# Altium schematic sheet Laser.SchDoc
size A2
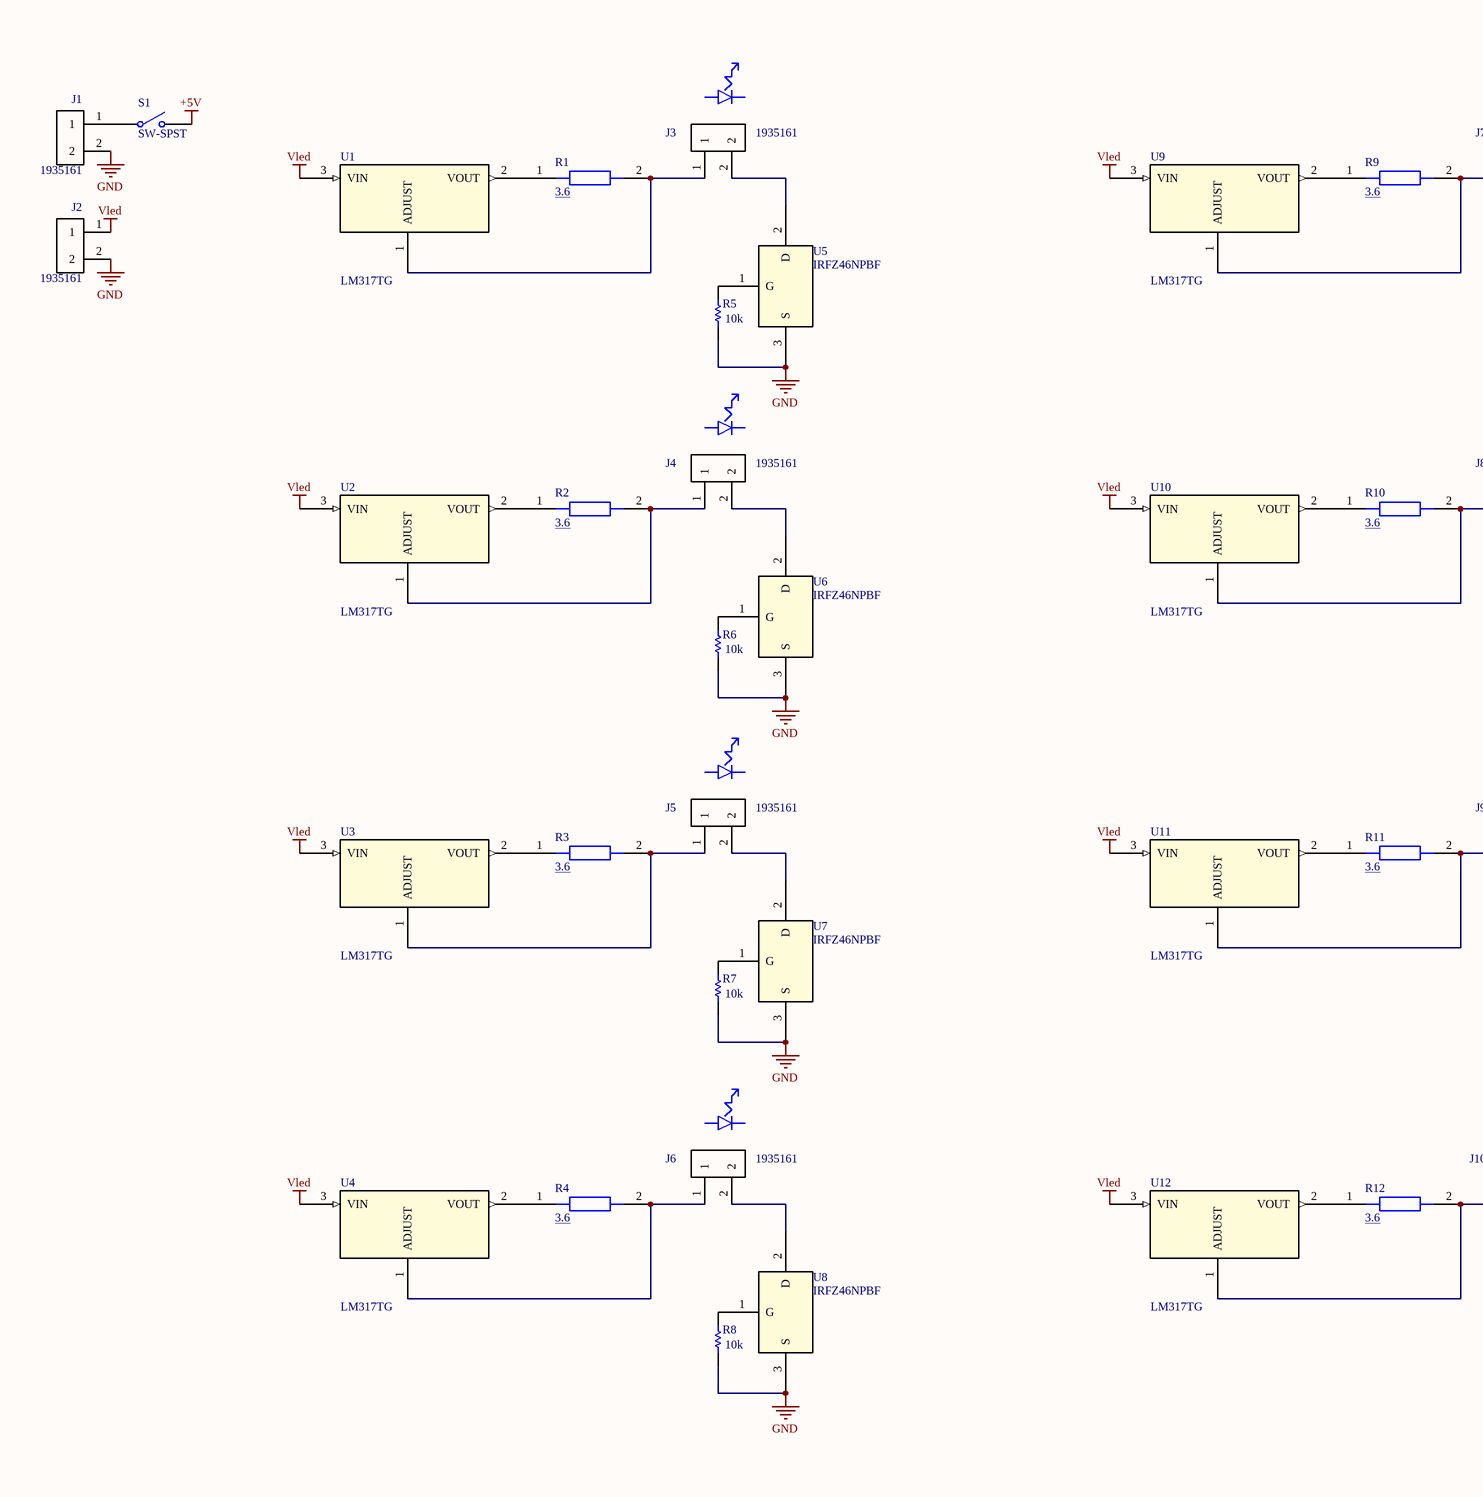
[diagram p0: Laser.SchDoc, left]
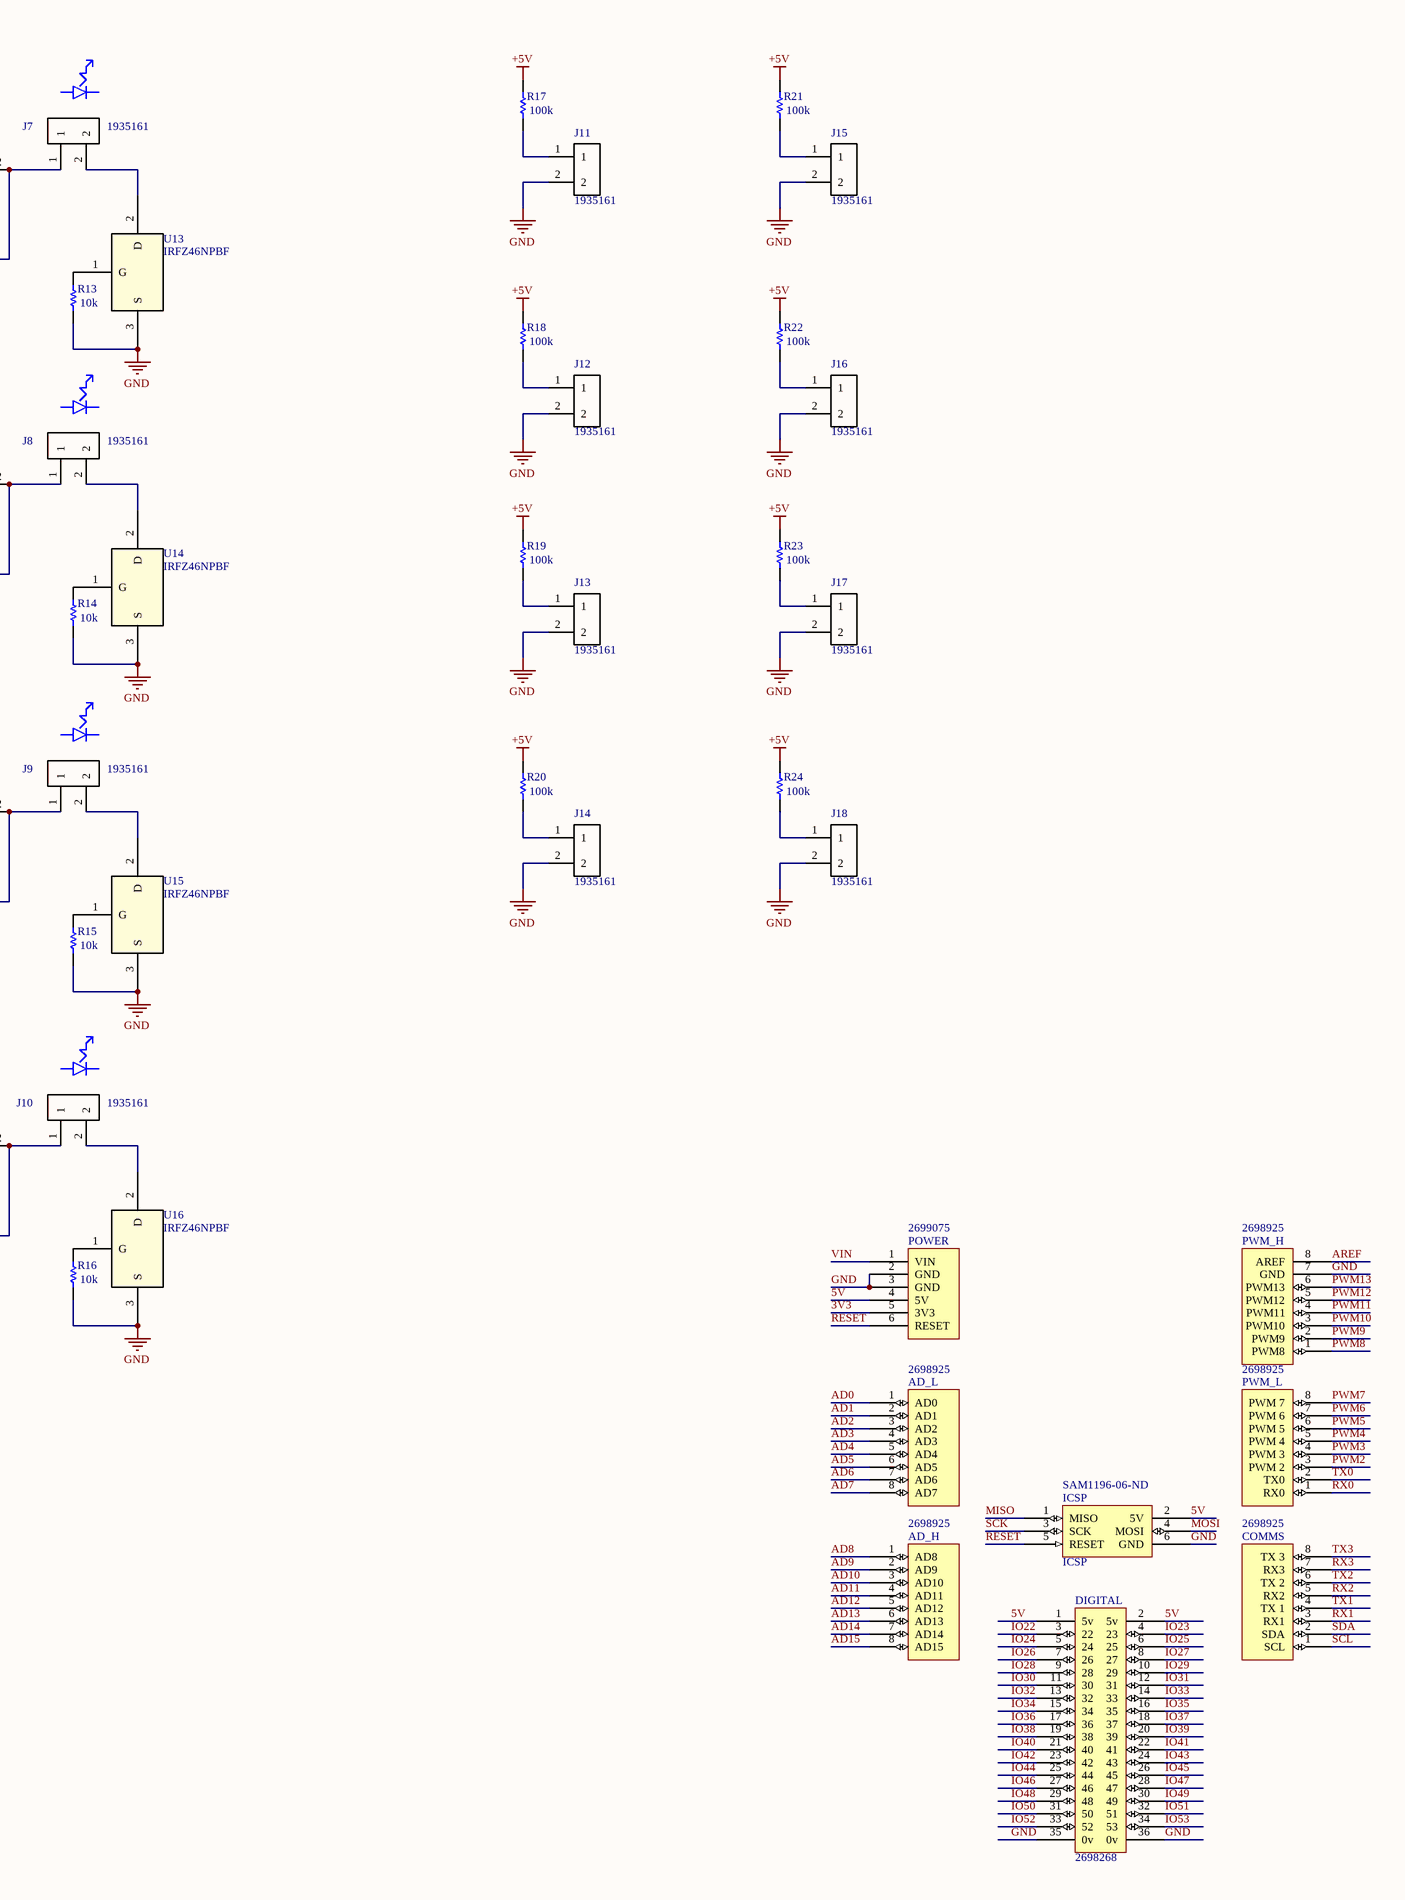
[diagram p1: Laser.SchDoc, right]

## Parts
AD_H  Supplier Part Number 4: 2698925  [Header 8x1 8.5mm]  (hidden comment: AD_H)
AD_L  Supplier Part Number 5: 2698925  [Header 8x1 8.5mm]  (hidden comment: AD_L)
COMMS  Supplier Part Number 4: 2698925  [Header 8x1 8.5mm]  (hidden comment: Communication)
DIGITAL  Supplier Part Number 5: 2698268  [HEADER 36X 8MM]  (hidden comment: IO_36)
ICSP  ICSP  Supplier Part Number 5: SAM1196-06-ND  [ICSP]
J1  1935161  [PHOENIX_1935161]
J2  1935161  [PHOENIX_1935161]
J3  1935161  [PHOENIX_1935161]
J4  1935161  [PHOENIX_1935161]
J5  1935161  [PHOENIX_1935161]
J6  1935161  [PHOENIX_1935161]
J7  1935161  [PHOENIX_1935161]
J8  1935161  [PHOENIX_1935161]
J9  1935161  [PHOENIX_1935161]
J10  1935161  [PHOENIX_1935161]
J11  1935161  [PHOENIX_1935161]
J12  1935161  [PHOENIX_1935161]
J13  1935161  [PHOENIX_1935161]
J14  1935161  [PHOENIX_1935161]
J15  1935161  [PHOENIX_1935161]
J16  1935161  [PHOENIX_1935161]
J17  1935161  [PHOENIX_1935161]
J18  1935161  [PHOENIX_1935161]
POWER  Supplier Part Number 2: 2699075  [Header 6x1 8.5mm]  (hidden comment: POWER)
PWM_H  Supplier Part Number 4: 2698925  [Header 8x1 8.5mm]  (hidden comment: PWM_H)
PWM_L  Supplier Part Number 4: 2698925  [Header 8x1 8.5mm]  (hidden comment: PWM_L)
R1  3.6  [3.6_R]
R2  3.6  [3.6_R]
R3  3.6  [3.6_R]
R4  3.6  [3.6_R]
R5  value 10k  [AXIAL-0.3]  (hidden comment: Res1)
R6  value 10k  [AXIAL-0.3]  (hidden comment: Res1)
R7  value 10k  [AXIAL-0.3]  (hidden comment: Res1)
R8  value 10k  [AXIAL-0.3]  (hidden comment: Res1)
R9  3.6  [3.6_R]
R10  3.6  [3.6_R]
R11  3.6  [3.6_R]
R12  3.6  [3.6_R]
R13  value 10k  [AXIAL-0.3]  (hidden comment: Res1)
R14  value 10k  [AXIAL-0.3]  (hidden comment: Res1)
R15  value 10k  [AXIAL-0.3]  (hidden comment: Res1)
R16  value 10k  [AXIAL-0.3]  (hidden comment: Res1)
R17  value 100k  [AXIAL-0.3]  (hidden comment: Res1)
R18  value 100k  [AXIAL-0.3]  (hidden comment: Res1)
R19  value 100k  [AXIAL-0.3]  (hidden comment: Res1)
R20  value 100k  [AXIAL-0.3]  (hidden comment: Res1)
R21  value 100k  [AXIAL-0.3]  (hidden comment: Res1)
R22  value 100k  [AXIAL-0.3]  (hidden comment: Res1)
R23  value 100k  [AXIAL-0.3]  (hidden comment: Res1)
R24  value 100k  [AXIAL-0.3]  (hidden comment: Res1)
S1  SW-SPST  [SPST-2]
U1  LM317TG  [TO-220AB]
U2  LM317TG  [TO-220AB]
U3  LM317TG  [TO-220AB]
U4  LM317TG  [TO-220AB]
U5  IRFZ46NPBF  [TO-220AB]
U6  IRFZ46NPBF  [TO-220AB]
U7  IRFZ46NPBF  [TO-220AB]
U8  IRFZ46NPBF  [TO-220AB]
U9  LM317TG  [TO-220AB]
U10  LM317TG  [TO-220AB]
U11  LM317TG  [TO-220AB]
U12  LM317TG  [TO-220AB]
U13  IRFZ46NPBF  [TO-220AB]
U14  IRFZ46NPBF  [TO-220AB]
U15  IRFZ46NPBF  [TO-220AB]
U16  IRFZ46NPBF  [TO-220AB]

## Nets
+5V: R17.2 R18.2 R19.2 R20.2 R21.2 R22.2 R23.2 R24.2 S1.2(NO)
GND: DIGITAL.35(0v) DIGITAL.36(0v) ICSP.6(GND) J1.2 J2.2 J11.2 J12.2 J13.2 J14.2 J15.2 J16.2 J17.2 J18.2 POWER.2(GND) POWER.3(GND) PWM_H.7(GND) R5.1 R6.1 R7.1 R8.1 R13.1 R14.1 R15.1 R16.1 U5.3(S) U6.3(S) U7.3(S) U8.3(S) U13.3(S) U14.3(S) U15.3(S) U16.3(S)
Vled: J2.1 U1.3(VIN) U2.3(VIN) U3.3(VIN) U4.3(VIN) U9.3(VIN) U10.3(VIN) U11.3(VIN) U12.3(VIN)
3V3: POWER.5(3V3)
5V: DIGITAL.1(5v) DIGITAL.2(5v) ICSP.2(5V) POWER.4(5V)
AD0: AD_L.1(AD0)
AD1: AD_L.2(AD1)
AD2: AD_L.3(AD2)
AD3: AD_L.4(AD3)
AD4: AD_L.5(AD4)
AD5: AD_L.6(AD5)
AD6: AD_L.7(AD6)
AD7: AD_L.8(AD7)
AD8: AD_H.1(AD8)
AD9: AD_H.2(AD9)
AD10: AD_H.3(AD10)
AD11: AD_H.4(AD11)
AD12: AD_H.5(AD12)
AD13: AD_H.6(AD13)
AD14: AD_H.7(AD14)
AD15: AD_H.8(AD15)
AREF: PWM_H.8(AREF)
IO22: DIGITAL.3(22)
IO23: DIGITAL.4(23)
IO24: DIGITAL.5(24)
IO25: DIGITAL.6(25)
IO26: DIGITAL.7(26)
IO27: DIGITAL.8(27)
IO28: DIGITAL.9(28)
IO29: DIGITAL.10(29)
IO30: DIGITAL.11(30)
IO31: DIGITAL.12(31)
IO32: DIGITAL.13(32)
IO33: DIGITAL.14(33)
IO34: DIGITAL.15(34)
IO35: DIGITAL.16(35)
IO36: DIGITAL.17(36)
IO37: DIGITAL.18(37)
IO38: DIGITAL.19(38)
IO39: DIGITAL.20(39)
IO40: DIGITAL.21(40)
IO41: DIGITAL.22(41)
IO42: DIGITAL.23(42)
IO43: DIGITAL.24(43)
IO44: DIGITAL.25(44)
IO45: DIGITAL.26(45)
IO46: DIGITAL.27(46)
IO47: DIGITAL.28(47)
IO48: DIGITAL.29(48)
IO49: DIGITAL.30(49)
IO50: DIGITAL.31(50)
IO51: DIGITAL.32(51)
IO52: DIGITAL.33(52)
IO53: DIGITAL.34(53)
MISO: ICSP.1(MISO)
MOSI: ICSP.4(MOSI)
PWM2: PWM_L.3(PWM_2)
PWM3: PWM_L.4(PWM_3)
PWM4: PWM_L.5(PWM_4)
PWM5: PWM_L.6(PWM_5)
PWM6: PWM_L.7(PWM_6)
PWM7: PWM_L.8(PWM_7)
PWM8: PWM_H.1(PWM8)
PWM9: PWM_H.2(PWM9)
PWM10: PWM_H.3(PWM10)
PWM11: PWM_H.4(PWM11)
PWM12: PWM_H.5(PWM12)
PWM13: PWM_H.6(PWM13)
RESET: ICSP.5(RESET) POWER.6(RESET)
RX0: PWM_L.1(RX0)
RX1: COMMS.3(RX1)
RX2: COMMS.5(RX2)
RX3: COMMS.7(RX3)
SCK: ICSP.3(SCK)
SCL: COMMS.1(SCL)
SDA: COMMS.2(SDA)
TX0: PWM_L.2(TX0)
TX1: COMMS.4(TX_1)
TX2: COMMS.6(TX_2)
TX3: COMMS.8(TX_3)
VIN: POWER.1(VIN)
NetJ1_1: J1.1 S1.1(COMMON)
NetJ3_1: J3.1 R1.2 U1.1(ADJUST)
NetJ3_2: J3.2 U5.2(D)
NetJ4_1: J4.1 R2.2 U2.1(ADJUST)
NetJ4_2: J4.2 U6.2(D)
NetJ5_1: J5.1 R3.2 U3.1(ADJUST)
NetJ5_2: J5.2 U7.2(D)
NetJ6_1: J6.1 R4.2 U4.1(ADJUST)
NetJ6_2: J6.2 U8.2(D)
NetJ7_1: J7.1 R9.2 U9.1(ADJUST)
NetJ7_2: J7.2 U13.2(D)
NetJ8_1: J8.1 R10.2 U10.1(ADJUST)
NetJ8_2: J8.2 U14.2(D)
NetJ9_1: J9.1 R11.2 U11.1(ADJUST)
NetJ9_2: J9.2 U15.2(D)
NetJ10_1: J10.1 R12.2 U12.1(ADJUST)
NetJ10_2: J10.2 U16.2(D)
NetJ11_1: J11.1 R17.1
NetJ12_1: J12.1 R18.1
NetJ13_1: J13.1 R19.1
NetJ14_1: J14.1 R20.1
NetJ15_1: J15.1 R21.1
NetJ16_1: J16.1 R22.1
NetJ17_1: J17.1 R23.1
NetJ18_1: J18.1 R24.1
NetR1_1: R1.1 U1.2(VOUT)
NetR2_1: R2.1 U2.2(VOUT)
NetR3_1: R3.1 U3.2(VOUT)
NetR4_1: R4.1 U4.2(VOUT)
NetR5_2: R5.2 U5.1(G)
NetR6_2: R6.2 U6.1(G)
NetR7_2: R7.2 U7.1(G)
NetR8_2: R8.2 U8.1(G)
NetR9_1: R9.1 U9.2(VOUT)
NetR10_1: R10.1 U10.2(VOUT)
NetR11_1: R11.1 U11.2(VOUT)
NetR12_1: R12.1 U12.2(VOUT)
NetR13_2: R13.2 U13.1(G)
NetR14_2: R14.2 U14.1(G)
NetR15_2: R15.2 U15.1(G)
NetR16_2: R16.2 U16.1(G)

## Notes on the sheet
- Title
- Size:
- Date:
- File:
- A2
- Number:
- Time:
- Revision:
- Sheet
- of

## Library data of the parts
J1-J18 = 1935161: Conn Terminal Blocks 2 POS 5mm Solder ST Thru-Hole 16A; MF: Phoenix Contact; Digi-Key_Part_Number: 277-1667-ND; Package: None; SnapEDA_Link: https://www.snapeda.com/parts/1935161/Phoenix%20Contact/view-part/?ref=snap; MP: 1935161; Digi-Key_Purchase_URL: https://www.digikey.com/product-detail/en/phoenix-contact/1935161/277-1667-ND/568614?utm_source=snapeda&utm_medium=aggregator&utm_campaign=symbol; Value: *
R5-R8 R13-R24 = Res1: Resistor; Published: 8-Jun-2000; LatestRevisionDate: 17-Jul-2002; LatestRevisionNote: Re-released for DXP Platform.; PackageReference: AXIAL-0.3; Publisher: Altium Limited
S1 = SW-SPST: Single-Pole, Single-Throw Switch; Published: 24-Mar-1999; LatestRevisionDate: 17-Jul-2002; LatestRevisionNote: Re-released for DXP Platform.; PackageReference: SPST-2; Publisher: Altium Limited
U1-U4 U9-U12 = LM317TG: Imported; Vendor: ON Semiconductor; Built_By: EMA_UL_Team; C: Copyright (C) 2015 Accelerated Designs. All rights reserved; Manufacturer_Part_Number: LM317TG; RefDes: RefDes; Type: DEV; Value: Value
U5-U8 U13-U16 = IRFZ46NPBF: Imported; Vendor: LITE-ON; Built_By: EMA_UL_Team; C: Copyright (C) 2015 Accelerated Designs. All rights reserved; Manufacturer_Part_Number: IRFZ46NPBF; RefDes: RefDes; Type: DEV; Value: Value
AD_H = AD_H: Supplier 1: Arrow; Supplier Part Number 1: 2698940; Supplier 2: Arrow; Supplier Part Number 2: 2698939; Supplier 3: Digi-Key; Supplier Part Number 3: SAM1198-08-ND; Supplier 4: Arrow
AD_L = AD_L: Supplier 1: Digi-Key; Supplier Part Number 1: SAM1198-08-ND; Supplier 2: Arrow; Supplier Part Number 2: 2698939; Supplier 3: Arrow; Supplier Part Number 3: 2698940; Supplier 4: Arrow; Supplier Part Number 4: 43085273; Supplier 5: Arrow
COMMS = Communication: Supplier 1: Digi-Key; Supplier Part Number 1: SAM1198-08-ND; Supplier 2: Arrow; Supplier Part Number 2: 2698940; Supplier 3: Arrow; Supplier Part Number 3: 2698939; Supplier 4: Arrow
DIGITAL = IO_36: Supplier 1: Digi-Key; Supplier Part Number 1: SAM1196-18-ND; Supplier 2: Arrow; Supplier Part Number 2: 48117090; Supplier 3: Arrow; Supplier Part Number 3: 46093326; Supplier 4: Arrow; Supplier Part Number 4: 2698278; Supplier 5: Arrow
ICSP = ICSP: Supplier 1: Digi-Key; Supplier Part Number 1: SAM1185-06-ND; Supplier 2: Arrow; Supplier Part Number 2: 2699117; Supplier 3: Arrow; Supplier Part Number 3: 43862781; Supplier 4: Arrow; Supplier Part Number 4: 2699091; Supplier 5: Digi-Key
POWER = POWER: Supplier 1: Arrow; Supplier Part Number 1: 52553843; Supplier 2: Arrow; Supplier 3: Digi-Key; Supplier Part Number 3: SAM1198-06-ND; Supplier 4: Arrow; Supplier Part Number 4: 2699089; Supplier 5: Arrow; Supplier Part Number 5: 2699088
PWM_H = PWM_H: Supplier 1: Digi-Key; Supplier Part Number 1: SAM1198-08-ND; Supplier 2: Arrow; Supplier Part Number 2: 2698940; Supplier 3: Arrow; Supplier Part Number 3: 2698939; Supplier 4: Arrow
PWM_L = PWM_L: Supplier 1: Arrow; Supplier Part Number 1: 2698940; Supplier 2: Arrow; Supplier Part Number 2: 2698939; Supplier 3: Digi-Key; Supplier Part Number 3: SAM1198-08-ND; Supplier 4: Arrow